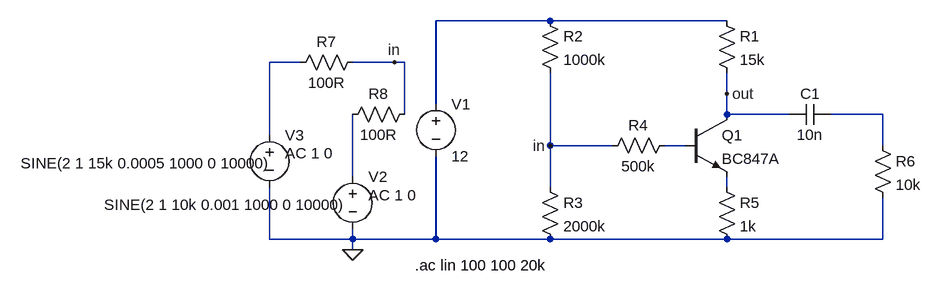
[diagram p0: schematic OE_npn_amp.asc]
OE_npn_amp.asc, the LTspice schematic file:
Version 4
SHEET 1 1404 680
WIRE -16 -48 -192 -48
WIRE 256 -48 -16 -48
WIRE -400 16 -448 16
WIRE -256 16 -320 16
WIRE -240 16 -256 16
WIRE 256 64 256 32
WIRE -192 80 -192 -48
WIRE -240 96 -240 16
WIRE 256 96 256 64
WIRE 352 96 256 96
WIRE 496 96 416 96
WIRE -448 128 -448 16
WIRE -16 144 -16 32
WIRE 80 144 -16 144
WIRE 192 144 160 144
WIRE 496 144 496 96
WIRE -320 192 -320 96
WIRE -16 208 -16 144
WIRE 256 208 256 192
WIRE -448 288 -448 208
WIRE -320 288 -320 272
WIRE -320 288 -448 288
WIRE -192 288 -192 160
WIRE -192 288 -320 288
WIRE -16 288 -192 288
WIRE 256 288 -16 288
WIRE 496 288 496 224
WIRE 496 288 256 288
WIRE -320 304 -320 288
FLAG 256 64 out
FLAG -16 144 in
FLAG -320 304 0
FLAG -256 16 in
DATAFLAG 496 112 ""
DATAFLAG 448 96 ""
SYMBOL npn 192 96 R0
SYMATTR InstName Q1
SYMATTR Value BC847A
SYMBOL res 240 -64 R0
SYMATTR InstName R1
SYMATTR Value 15k
SYMBOL res -32 -64 R0
SYMATTR InstName R2
SYMATTR Value 1000k
SYMBOL res -32 192 R0
SYMATTR InstName R3
SYMATTR Value 2000k
SYMBOL res 176 128 R90
WINDOW 0 0 56 VBottom 2
WINDOW 3 32 56 VTop 2
SYMATTR InstName R4
SYMATTR Value 500k
SYMBOL voltage -192 64 R0
WINDOW 123 0 0 Left 0
WINDOW 39 0 0 Left 0
SYMATTR InstName V1
SYMATTR Value 12
SYMBOL voltage -320 176 R0
WINDOW 3 -383 59 Left 2
WINDOW 123 24 44 Left 2
WINDOW 39 0 0 Left 0
SYMATTR Value SINE(2 1 10k 0.001 1000 0 10000)
SYMATTR Value2 AC 1 0
SYMATTR InstName V2
SYMBOL res 240 192 R0
SYMATTR InstName R5
SYMATTR Value 1k
SYMBOL cap 416 80 R90
WINDOW 0 0 32 VBottom 2
WINDOW 3 32 32 VTop 2
SYMATTR InstName C1
SYMATTR Value 10n
SYMBOL res 480 128 R0
SYMATTR InstName R6
SYMATTR Value 10k
SYMBOL voltage -448 112 R0
WINDOW 3 -383 59 Left 2
WINDOW 123 24 44 Left 2
WINDOW 39 0 0 Left 0
SYMATTR Value SINE(2 1 15k 0.0005 1000 0 10000)
SYMATTR Value2 AC 1 0
SYMATTR InstName V3
SYMBOL res -304 0 R90
WINDOW 0 0 56 VBottom 2
WINDOW 3 32 56 VTop 2
SYMATTR InstName R7
SYMATTR Value 100R
SYMBOL res -224 80 R90
WINDOW 0 0 56 VBottom 2
WINDOW 3 32 56 VTop 2
SYMATTR InstName R8
SYMATTR Value 100R
TEXT -224 328 Left 2 !.ac lin 100 100 20k

The netlist it stands for:
* OE_npn_amp.asc
Q1 out N004 N006 0 BC847A
R1 N001 out 15k
R2 N001 in 1000k
R3 in 0 2000k
R4 N004 in 500k
V1 N001 0 12
V2 N005 0 SINE(2 1 10k 0.001 1000 0 10000) AC 1 0
R5 N006 0 1k
C1 N003 out 10n
R6 N003 0 10k
V3 N002 0 SINE(2 1 15k 0.0005 1000 0 10000) AC 1 0
R7 in N002 100R
R8 in N005 100R
.model NPN NPN
.model PNP PNP
.lib standard.bjt
.ac lin 100 100 20k
.backanno
.end